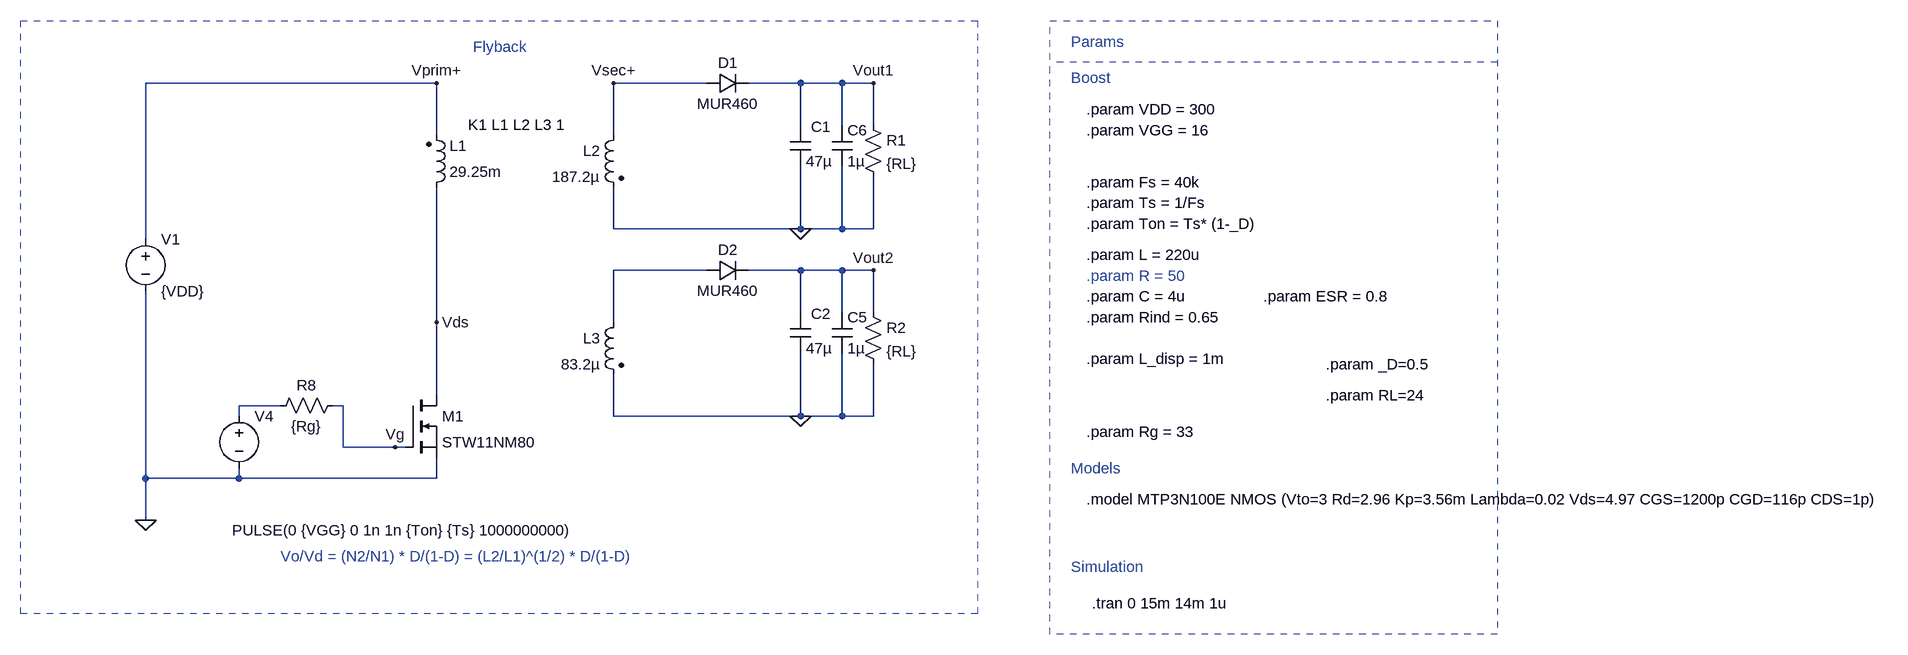
[diagram p0: schematic FlyBack_Open_Loop_Ideal.asc]
FlyBack_Open_Loop_Ideal.asc, the LTspice schematic file:
Version 4
SHEET 1 2728 2080
WIRE 48 -240 -400 -240
WIRE 464 -240 320 -240
WIRE 608 -240 528 -240
WIRE 672 -240 608 -240
WIRE 720 -240 672 -240
WIRE 608 -176 608 -240
WIRE 672 -176 672 -240
WIRE 720 -176 720 -240
WIRE 48 -160 48 -240
WIRE 320 -160 320 -240
WIRE 320 -16 320 -80
WIRE 608 -16 608 -112
WIRE 608 -16 320 -16
WIRE 672 -16 672 -112
WIRE 672 -16 608 -16
WIRE 720 -16 720 -96
WIRE 720 -16 672 -16
WIRE -400 0 -400 -240
WIRE 464 48 320 48
WIRE 608 48 528 48
WIRE 672 48 608 48
WIRE 720 48 672 48
WIRE 608 112 608 48
WIRE 672 112 672 48
WIRE 720 112 720 48
WIRE 48 128 48 -80
WIRE 320 128 320 48
WIRE 48 240 48 128
WIRE -192 256 -256 256
WIRE -96 256 -112 256
WIRE -256 272 -256 256
WIRE 320 272 320 208
WIRE 608 272 608 176
WIRE 608 272 320 272
WIRE 672 272 672 176
WIRE 672 272 608 272
WIRE 720 272 720 192
WIRE 720 272 672 272
WIRE -96 320 -96 256
WIRE -16 320 -96 320
WIRE 0 320 -16 320
WIRE -400 368 -400 80
WIRE -256 368 -256 352
WIRE -256 368 -400 368
WIRE 48 368 48 336
WIRE 48 368 -256 368
WIRE -400 432 -400 368
FLAG -400 432 0
FLAG 720 -240 Vout1
FLAG 720 48 Vout2
FLAG 320 -240 Vsec+
FLAG 48 128 Vds
FLAG 48 -240 Vprim+
FLAG -16 320 Vg
FLAG 608 -16 0
FLAG 608 272 0
SYMBOL nmos 0 240 R0
SYMATTR InstName M1
SYMATTR Value STW11NM80
SYMBOL diode 464 -224 R270
WINDOW 0 32 32 VTop 2
WINDOW 3 0 32 VBottom 2
SYMATTR InstName D1
SYMATTR Value MUR460
SYMBOL voltage -400 -16 R0
WINDOW 123 0 0 Left 0
WINDOW 39 0 0 Left 0
SYMATTR InstName V1
SYMATTR Value {VDD}
SYMBOL res -96 240 R90
WINDOW 0 0 56 VBottom 2
WINDOW 3 32 56 VTop 2
SYMATTR InstName R8
SYMATTR Value {Rg}
SYMBOL cap 592 -176 R0
WINDOW 0 32 3 Left 2
SYMATTR InstName C1
SYMATTR Value 47µ
SYMBOL res 704 -192 R0
SYMATTR InstName R1
SYMATTR Value {RL}
SYMBOL ind2 32 -64 M180
WINDOW 0 36 80 Left 2
WINDOW 3 36 40 Left 2
SYMATTR InstName L1
SYMATTR Value 29.25m
SYMATTR Type ind
SYMBOL ind2 336 -176 M0
SYMATTR InstName L2
SYMATTR Value 187.2µ
SYMATTR Type ind
SYMBOL diode 464 64 R270
WINDOW 0 32 32 VTop 2
WINDOW 3 0 32 VBottom 2
SYMATTR InstName D2
SYMATTR Value MUR460
SYMBOL cap 592 112 R0
WINDOW 0 32 3 Left 2
SYMATTR InstName C2
SYMATTR Value 47µ
SYMBOL res 704 96 R0
SYMATTR InstName R2
SYMATTR Value {RL}
SYMBOL ind2 336 112 M0
SYMATTR InstName L3
SYMATTR Value 83.2µ
SYMATTR Type ind
SYMBOL cap 656 112 R0
SYMATTR InstName C5
SYMATTR Value 1µ
SYMBOL cap 656 -176 R0
SYMATTR InstName C6
SYMATTR Value 1µ
SYMBOL voltage -256 256 R0
WINDOW 3 -11 192 Left 2
WINDOW 123 0 0 Left 0
WINDOW 39 0 0 Left 0
SYMATTR Value PULSE(0 {VGG} 0 1n 1n {Ton} {Ts} 1000000000)
SYMATTR InstName V4
TEXT -192 488 Left 2 ;Vo/Vd = (N2/N1) * D/(1-D) = (L2/L1)^(1/2) * D/(1-D)
TEXT 96 -176 Left 2 !K1 L1 L2 L3 1
TEXT 104 -296 Left 2 ;Flyback
TEXT 1048 400 Left 2 !.model MTP3N100E NMOS (Vto=3 Rd=2.96 Kp=3.56m Lambda=0.02 Vds=4.97 CGS=1200p CGD=116p CDS=1p)
TEXT 1048 24 Left 2 !.param L = 220u
TEXT 1048 56 Left 2 ;.param R = 50
TEXT 1048 88 Left 2 !.param C = 4u
TEXT 1056 560 Left 2 !.tran 0 15m 14m 1u
TEXT 1048 -200 Left 2 !.param VDD = 300
TEXT 1416 192 Left 2 !.param _D=0.5
TEXT 1048 -88 Left 2 !.param Fs = 40k
TEXT 1048 -56 Left 2 !.param Ts = 1/Fs
TEXT 1048 -24 Left 2 !.param Ton = Ts* (1-_D)
TEXT 1024 -304 Left 2 ;Params
TEXT 1024 -248 Left 2 ;Boost
TEXT 1048 -168 Left 2 !.param VGG = 16
TEXT 1048 296 Left 2 !.param Rg = 33
TEXT 1024 352 Left 2 ;Models
TEXT 1024 504 Left 2 ;Simulation
TEXT 1048 120 Left 2 !.param Rind = 0.65
TEXT 1416 240 Left 2 !.param RL=24
TEXT 1320 88 Left 2 !.param ESR = 0.8
TEXT 1048 184 Left 2 !.param L_disp = 1m
LINE Normal 1680 -272 992 -272 2
RECTANGLE Normal 880 576 -592 -336 2
RECTANGLE Normal 1680 608 992 -336 2

The netlist it stands for:
* FlyBack_Open_Loop_Ideal.asc
M1 Vds Vg 0 0 STW11NM80
D1 Vsec+ Vout1 MUR460
V1 Vprim+ 0 {VDD}
R8 Vg N002 {Rg}
C1 Vout1 0 47µ
R1 Vout1 0 {RL}
L1 Vds Vprim+ 29.25m
L2 Vsec+ 0 187.2µ
D2 N001 Vout2 MUR460
C2 Vout2 0 47µ
R2 Vout2 0 {RL}
L3 N001 0 83.2µ
C5 Vout2 0 1µ
C6 Vout1 0 1µ
V4 N002 0 PULSE(0 {VGG} 0 1n 1n {Ton} {Ts} 1000000000)
.model D D
.lib standard.dio
.model NMOS NMOS
.model PMOS PMOS
.lib standard.mos
* Vo/Vd = (N2/N1) * D/(1-D) = (L2/L1)^(1/2) * D/(1-D)
K1 L1 L2 L3 1
* Flyback
.model MTP3N100E NMOS (Vto=3 Rd=2.96 Kp=3.56m Lambda=0.02 Vds=4.97 CGS=1200p CGD=116p CDS=1p)
.param L = 220u
* .param R = 50
.param C = 4u
.tran 0 15m 14m 1u
.param VDD = 300
.param _D=0.5
.param Fs = 40k
.param Ts = 1/Fs
.param Ton = Ts* (1-_D)
* Params
* Boost
.param VGG = 16
.param Rg = 33
* Models
* Simulation
.param Rind = 0.65
.param RL=24
.param ESR = 0.8
.param L_disp = 1m
.backanno
.end